# Altium schematic sheet yuanlitu.SchDoc
size A4
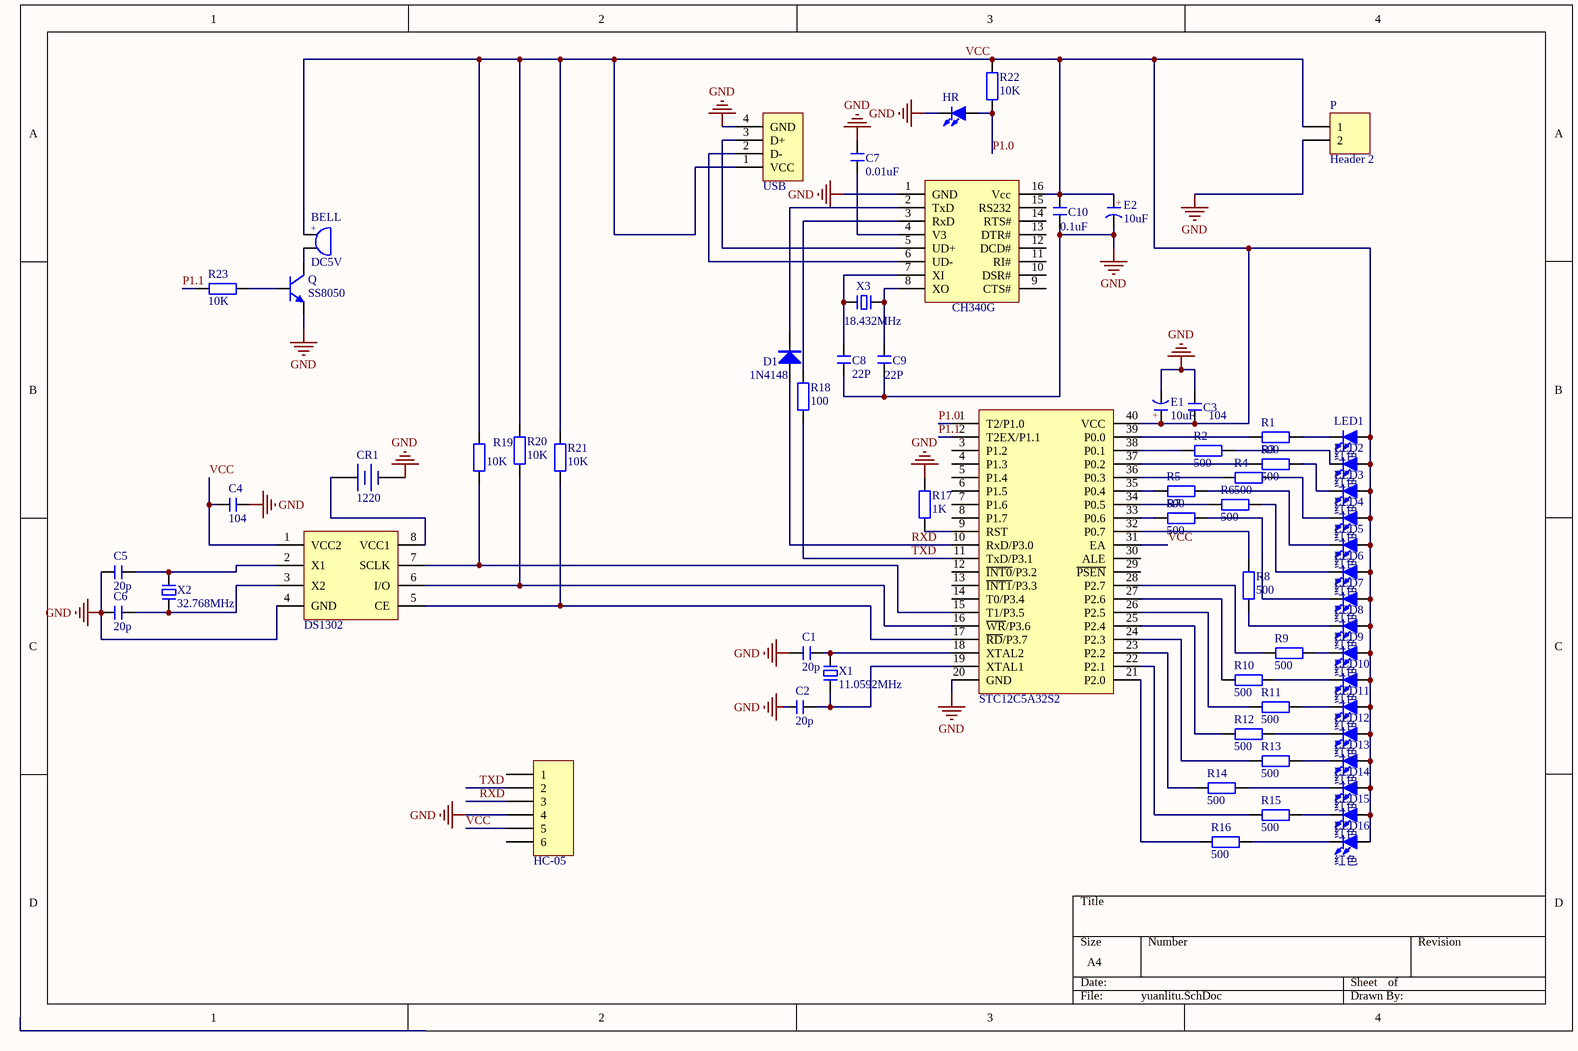
[diagram p0: yuanlitu.SchDoc]

## Parts
?  STC12C5A32S2  [DIP40-600]
BELL  DC5V  [BEEP 7.6X12X7.5]
C1  20p  [CC 1.8*3.6]
C2  20p  [CC 1.8*3.6]
C3  104  [CC 1.8*3.6]
C4  104  [CC 1.8*3.6]
C5  20p  [CC 1.8*3.6]
C6  20p  [CC 1.8*3.6]
C7  0.01uF  [CC 1.8*3.6]
C8  22P  [CC 1.8*3.6]
C9  22P  [CC 1.8*3.6]
C10  0.1uF  [CC 1.8*3.6]
CR1  1220  [CR1220_A]
D1  1N4148  [DO-35]
E1  10uF  [CAP 2.0*5*11]
E2  10uF  [CAP 2.0*5*11]
HR  红色  [LED 3MM-R]  (value not drawn)
IC  DS1302  [SOP8_N]
IC1  CH340G  [SOP16_L]
LED1  红色  [LED 0805R]
LED2  红色  [LED 0805R]
LED3  红色  [LED 0805R]
LED4  红色  [LED 0805R]
LED5  红色  [LED 0805R]
LED6  红色  [LED 0805R]
LED7  红色  [LED 0805R]
LED8  红色  [LED 0805R]
LED9  红色  [LED 0805R]
LED10  红色  [LED 0805R]
LED11  红色  [LED 0805R]
LED12  红色  [LED 0805R]
LED13  红色  [LED 0805R]
LED14  红色  [LED 0805R]
LED15  红色  [LED 0805R]
LED16  红色  [LED 0805R]
P  Header 2  [HDR1X2]
P1  HC-05  [HDR1X6]
Q  SS8050  [SOT23-3M]
R1  500  [RS 1/4W]
R2  500  [RS 1/4W]
R3  500  [RS 1/4W]
R4  500  [RS 1/4W]
R5  500  [RS 1/4W]
R6  500  [RS 1/4W]
R7  500  [RS 1/4W]
R8  500  [RS 1/4W]
R9  500  [RS 1/4W]
R10  500  [RS 1/4W]
R11  500  [RS 1/4W]
R12  500  [RS 1/4W]
R13  500  [RS 1/4W]
R14  500  [RS 1/4W]
R15  500  [RS 1/4W]
R16  500  [RS 1/4W]
R17  1K  [RS 1/4W]
R18  100  [RS 1/4W]
R19  10K  [RS 1/4W]
R20  10K  [RS 1/4W]
R21  10K  [RS 1/4W]
R22  10K  [RS 1/4W]
R23  10K  [RS 1/4W]
USB  USB  [USB-A/S_A]
X1  11.0592MHz  [OSC HC-49S]
X2  32.768MHz  [OSC HC-49S]
X3  18.432MHz  [OSC HC-49S]

## Nets
GND: ?.20(GND) C1.1 C2.1 C3.2 C4.2 C5.1 C6.1 C7.1 C8.2 C9.2 C10.2 CR1.2(DC-) E1.2(K) E2.2(K) HR.2(K) IC.4(GND) IC1.1(GND) P.2 P1.4 Q.2(E) R17.1 USB.4(GND)
P1.0: ?.1(T2/P1.0) HR.1(A) R22.1
P1.1: ?.2(T2EX/P1.1) R23.2
RXD: ?.10(RxD/P3.0) D1.1(A) P1.3
TXD: ?.11(TxD/P3.1) P1.2 R18.1
VCC: ?.31(EA) ?.40(VCC) BELL.1 C3.1 C4.1 C10.1 E1.1(A) E2.1(A) IC.1(VCC2) IC1.16(Vcc) LED1.1(A) LED2.1(A) LED3.1(A) LED4.1(A) LED5.1(A) LED6.1(A) LED7.1(A) LED8.1(A) LED9.1(A) LED10.1(A) LED11.1(A) LED12.1(A) LED13.1(A) LED14.1(A) LED15.1(A) LED16.1(A) P.1 P1.5 R19.2 R20.2 R21.2 R22.2 USB.1(VCC)
Net?_9: ?.9(RST) R17.2
Net?_15: ?.15(T1/P3.5) IC.7(SCLK) R19.1
Net?_16: ?.16(~{WR}/P3.6) IC.6(I/O) R20.1
Net?_17: ?.17(~{RD}/P3.7) IC.5(CE) R21.1
Net?_18: ?.18(XTAL2) C1.2 X1.2
Net?_19: ?.19(XTAL1) C2.2 X1.1
Net?_21: ?.21(P2.0) R16.2
Net?_22: ?.22(P2.1) R15.2
Net?_23: ?.23(P2.2) R14.2
Net?_24: ?.24(P2.3) R13.2
Net?_25: ?.25(P2.4) R12.2
Net?_26: ?.26(P2.5) R11.2
Net?_27: ?.27(P2.6) R10.2
Net?_28: ?.28(P2.7) R9.2
Net?_32: ?.32(P0.7) R8.1
Net?_33: ?.33(P0.6) R7.2
Net?_34: ?.34(P0.5) R6.2
Net?_35: ?.35(P0.4) R5.2
Net?_36: ?.36(P0.3) R4.2
Net?_37: ?.37(P0.2) R3.2
Net?_38: ?.38(P0.1) R2.2
Net?_39: ?.39(P0.0) R1.2
NetBELL_2: BELL.2 Q.3(C)
NetC5_2: C5.2 IC.2(X1) X2.2
NetC6_2: C6.2 IC.3(X2) X2.1
NetC7_2: C7.2 IC1.4(V3)
NetC8_1: C8.1 IC1.7(XI) X3.2
NetC9_1: C9.1 IC1.8(XO) X3.1
NetCR1_1: CR1.1(DC+) IC.8(VCC1)
NetD1_2: D1.2(K) IC1.2(TxD)
NetIC1_3: IC1.3(RxD) R18.2
NetIC1_5: IC1.5(UD+) USB.3(D+)
NetIC1_6: IC1.6(UD-) USB.2(D-)
NetLED1_2: LED1.2(K) R1.1
NetLED2_2: LED2.2(K) R2.1
NetLED3_2: LED3.2(K) R3.1
NetLED4_2: LED4.2(K) R4.1
NetLED5_2: LED5.2(K) R5.1
NetLED6_2: LED6.2(K) R6.1
NetLED7_2: LED7.2(K) R7.1
NetLED8_2: LED8.2(K) R8.2
NetLED9_2: LED9.2(K) R9.1
NetLED10_2: LED10.2(K) R10.1
NetLED11_2: LED11.2(K) R11.1
NetLED12_2: LED12.2(K) R12.1
NetLED13_2: LED13.2(K) R13.1
NetLED14_2: LED14.2(K) R14.1
NetLED15_2: LED15.2(K) R15.1
NetLED16_2: LED16.2(K) R16.1
NetQ_1: Q.1(B) R23.1

Not connected (* = marked no-connect by the designer): ? 3(P1.2) 4(P1.3) 5(P1.4) 6(P1.5) 7(P1.6) 8(P1.7) 12(~{INT0}/P3.2) 13(~{INT1}/P3.3) 14(T0/P3.4) 29(~{PSEN}) 30(ALE); IC1 9(CTS#) 10(DSR#) 11(RI#) 12(DCD#) 13(DTR#) 14(RTS#) 15(RS232); P1 1 6

## Notes on the sheet
- (in symbol BEEP) +
- (in symbol C-CAP) +

## Library data of the parts
? = STC89C52RC: STC单片机; 版权归属: 源创客; BOM名称: STC单片机; 学习资源: www.ooocke.com
BELL = BEEP: 蜂鸣器; 版权归属: 源创客; BOM名称: 蜂鸣器; 学习资源: www.ooocke.com
C1-C10 = C-CC: 直插瓷片电容; 版权归属: 源创客; BOM名称: 直插瓷片电容; 学习资源: www.ooocke.com
CR1 = CR-3V: 微型电池; 版权归属: 源创客; BOM名称: 微型电池; 学习资源: www.ooocke.com
D1 = 1N4148: 高速开关二极管; 版权归属: 源创客; BOM名称: 高速开关二极管; 学习资源: www.ooocke.com
E1 E2 = C-CAP: 直插电解电容; 版权归属: 源创客; BOM名称: 直插电解电容; 学习资源: www.ooocke.com
HR = LED-3MM: 插件LED; 版权归属: 源创客; BOM名称: 插件LED; 学习资源: www.ooocke.com
IC = DS1302: 实时时钟芯片; 版权归属: 源创客; BOM名称: 实时时钟芯片; 学习资源: www.ooocke.com
IC1 = CH340G: 串口转USB; 版权归属: 源创客; BOM名称: 串口转USB; 学习资源: www.ooocke.com
LED1-LED16 = LED-SMD: 贴片LED; 版权归属: 源创客; BOM名称: 贴片LED; 学习资源: www.ooocke.com
P = Header 2: Header, 2-Pin; LatestRevisionDate: 17-Jul-2002; LatestRevisionNote: Re-released for DXP Platform.; Publisher: Altium Limited
P1 = Header 6: Header, 6-Pin; LatestRevisionDate: 17-Jul-2002; LatestRevisionNote: Re-released for DXP Platform.; Publisher: Altium Limited
Q = 8050-SMD: 高频放大-NPN型; 版权归属: 源创客; 属性: 40V 1.5A 1W 100MHZ; BOM名称: 高频放大-NPN型; 学习资源: www.ooocke.com
R1-R23 = R-CRR: 直插色环电阻; BOM名称: 色环电阻; 版权归属: 源创客; 学习资源: www.ooocke.com
USB = USB-A/S: USB-A型母接口; 版权归属: 源创客; BOM名称: USB-A型母接口; 学习资源: www.ooocke.com
X1-X3 = XTAL-2P: 2脚无源脚晶振; 版权归属: 源创客; BOM名称: 2脚无源脚晶振; 学习资源: www.ooocke.com